# EAGLE schematic 3D_PrinterControllerSchematic (EAGLE 7.5.0)
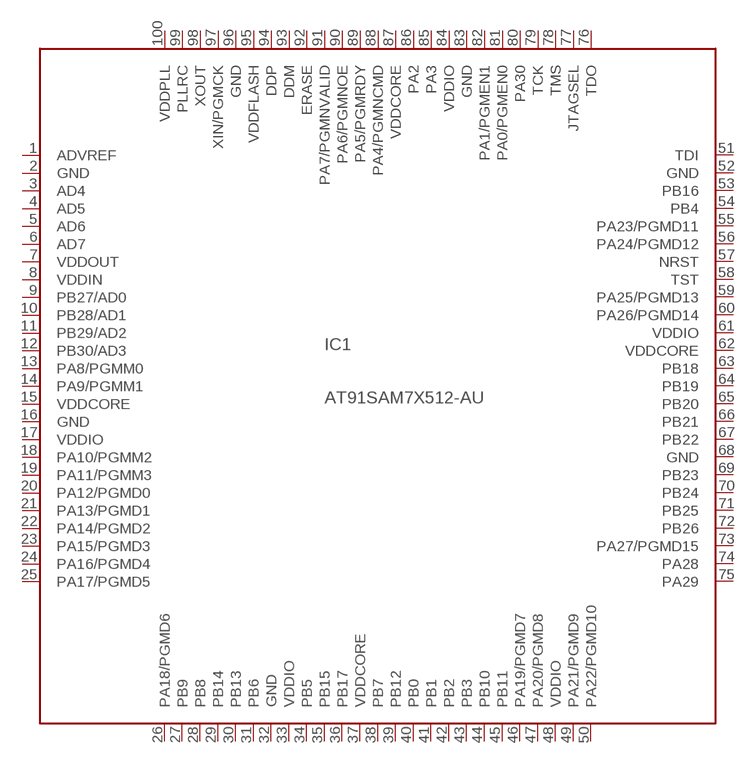
[diagram p0: schematic, sheet 1]

## Parts
IC1  AT91SAM7X512-AU  [LQFP100]
Unconnected: IC1.1(ADVREF) IC1.2(GND) IC1.3(AD4) IC1.4(AD5) IC1.5(AD6) IC1.6(AD7) IC1.7(VDDOUT) IC1.8(VDDIN) IC1.9(PB27/AD0) IC1.10(PB28/AD1) IC1.11(PB29/AD2) IC1.12(PB30/AD3) IC1.13(PA8/PGMM0) IC1.14(PA9/PGMM1) IC1.15(VDDCORE) IC1.16(GND) IC1.17(VDDIO) IC1.18(PA10/PGMM2) IC1.19(PA11/PGMM3) IC1.20(PA12/PGMD0) IC1.21(PA13/PGMD1) IC1.22(PA14/PGMD2) IC1.23(PA15/PGMD3) IC1.24(PA16/PGMD4) IC1.25(PA17/PGMD5) IC1.26(PA18/PGMD6) IC1.27(PB9) IC1.28(PB8) IC1.29(PB14) IC1.30(PB13) IC1.31(PB6) IC1.32(GND) IC1.33(VDDIO) IC1.34(PB5) IC1.35(PB15) IC1.36(PB17) IC1.37(VDDCORE) IC1.38(PB7) IC1.39(PB12) IC1.40(PB0) IC1.41(PB1) IC1.42(PB2) IC1.43(PB3) IC1.44(PB10) IC1.45(PB11) IC1.46(PA19/PGMD7) IC1.47(PA20/PGMD8) IC1.48(VDDIO) IC1.49(PA21/PGMD9) IC1.50(PA22/PGMD10) IC1.51(TDI) IC1.52(GND) IC1.53(PB16) IC1.54(PB4) IC1.55(PA23/PGMD11) IC1.56(PA24/PGMD12) IC1.57(NRST) IC1.58(TST) IC1.59(PA25/PGMD13) IC1.60(PA26/PGMD14) IC1.61(VDDIO) IC1.62(VDDCORE) IC1.63(PB18) IC1.64(PB19) IC1.65(PB20) IC1.66(PB21) IC1.67(PB22) IC1.68(GND) IC1.69(PB23) IC1.70(PB24) IC1.71(PB25) IC1.72(PB26) IC1.73(PA27/PGMD15) IC1.74(PA28) IC1.75(PA29) IC1.76(TDO) IC1.77(JTAGSEL) IC1.78(TMS) IC1.79(TCK) IC1.80(PA30) IC1.81(PA0/PGMEN0) IC1.82(PA1/PGMEN1) IC1.83(GND) IC1.84(VDDIO) IC1.85(PA3) IC1.86(PA2) IC1.87(VDDCORE) IC1.88(PA4/PGMNCMD) IC1.89(PA5/PGMRDY) IC1.90(PA6/PGMNOE) IC1.91(PA7/PGMNVALID) IC1.92(ERASE) IC1.93(DDM) IC1.94(DDP) IC1.95(VDDFLASH) IC1.96(GND) IC1.97(XIN/PGMCK) IC1.98(XOUT) IC1.99(PLLRC) IC1.100(VDDPLL)

## Library data of the parts
IC1 = atmel:AT91SAM7X*-AU: Highly integrated Flash microcontrollers based on the 32-bit ARM RISC processor 512/256/128 Kbyte high-speed Flash and 128/64/32 Kbyte SRAM, a large set of peripherals, including an 802.3 Ethernet MAC and a CAN controller Source: http://www.atmel.com/dyn/resources/prod_documents/6120s.pdf; MPN: AT91SAM7X512-AU; OC_FARNELL: 1288328; OC_NEWARK: 23M5090